# Altium schematic sheet Main Schematic.SchDoc
size A4
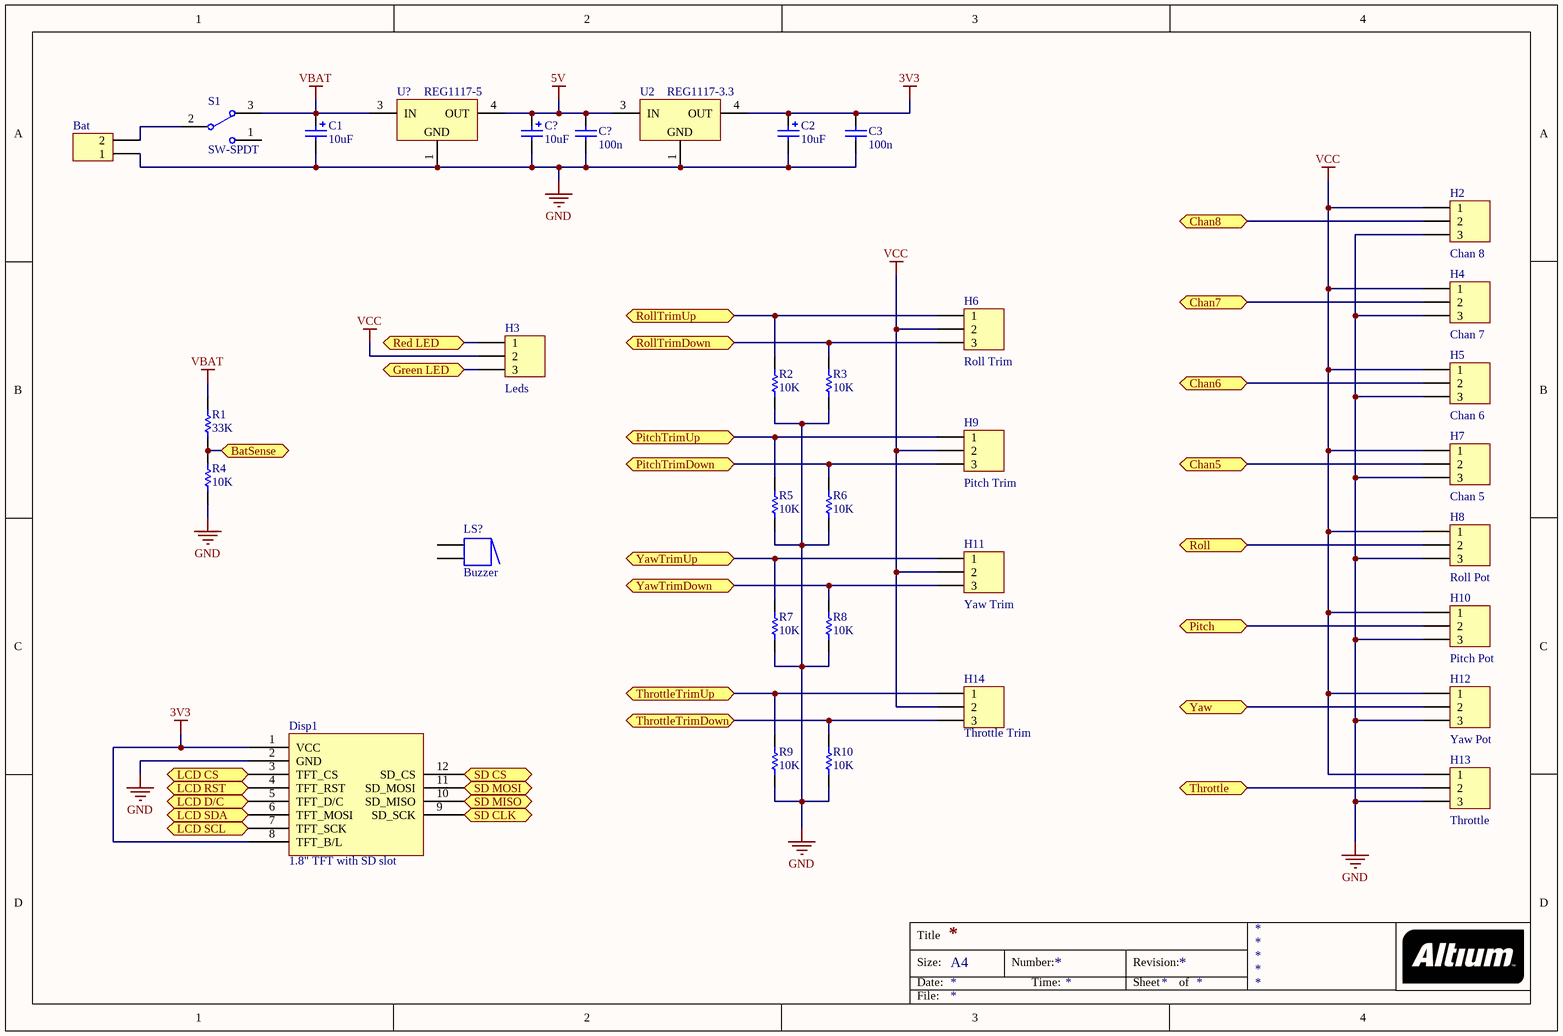
[diagram p0: Main Schematic.SchDoc]

## Parts
(Parts that share a designator on the sheet are numbered #1, #2 ... from top to bottom, then left to right.)
Bat  Header 2  [HDR1X2]  (value not drawn)
C1  value 10uF  [RB.1/.2]  (hidden comment: Cap Pol1)
C2  value 10uF  [RB.1/.2]  (hidden comment: Cap Pol1)
C3  value 100n  [RAD200_A]  (hidden comment: Cap)
C?#1  value 10uF  [RB.1/.2]  (hidden comment: Cap Pol1)
C?#2  value 100n  [RAD200_A]  (hidden comment: Cap)
Disp1  1.8" TFT with SD slot
H2  Chan 8  [HDR1X3]
H3  Leds  [HDR1X3]
H4  Chan 7  [HDR1X3]
H5  Chan 6  [HDR1X3]
H6  Roll Trim  [HDR1X3]
H7  Chan 5  [HDR1X3]
H8  Roll Pot  [HDR1X3]
H9  Pitch Trim  [HDR1X3]
H10  Pitch Pot  [HDR1X3]
H11  Yaw Trim  [HDR1X3]
H12  Yaw Pot  [HDR1X3]
H13  Throttle  [HDR1X3]
H14  Throttle Trim  [HDR1X3]
LS?  Buzzer  [ABSM-1574]
R1  value 33K  [AXIAL200]  (hidden comment: Res)
R2  value 10K  [0805]  (hidden comment: Res)
R3  value 10K  [0805]  (hidden comment: Res)
R4  value 10K  [AXIAL200]  (hidden comment: Res)
R5  value 10K  [0805]  (hidden comment: Res)
R6  value 10K  [0805]  (hidden comment: Res)
R7  value 10K  [0805]  (hidden comment: Res)
R8  value 10K  [0805]  (hidden comment: Res)
R9  value 10K  [0805]  (hidden comment: Res)
R10  value 10K  [0805]  (hidden comment: Res)
S1  SW-SPDT  [TL36WW15050]
U2  REG1117-3.3  [369A-13]
U?  REG1117-5  [369A-13]

## Ports
BatSense, Chan5, Chan6, Chan7, Chan8, Green LED, LCD CS, LCD D/C, LCD RST, LCD SCL, LCD SDA, Pitch, PitchTrimDown, PitchTrimUp, Red LED, Roll, RollTrimDown, RollTrimUp, SD CLK, SD CS, SD MISO, SD MOSI, Throttle, ThrottleTrimDown, ThrottleTrimUp, Yaw, YawTrimDown, YawTrimUp

## Nets
3V3: C2.1 C3.2 Disp1.1(VCC) Disp1.8(TFT_B/L) U2.4(OUT)
5V: C?#1.1 C?#2.2 U2.3(IN) U?.4(OUT)
GND: Bat.1 C1.2 C2.2 C3.1 C?#1.2 C?#2.1 Disp1.2(GND) H2.3 H4.3 H5.3 H7.3 H8.3 H10.3 H12.3 H13.3 R2.1 R3.1 R4.2 R5.1 R6.1 R7.1 R8.1 R9.2 R10.1 U2.1(GND) U?.1(GND)
VBAT: C1.1 R1.1 S1.3 U?.3(IN)
VCC: H2.1 H3.2 H4.1 H5.1 H6.2 H7.1 H8.1 H9.2 H10.1 H11.2 H12.1 H13.1 H14.2
BatSense: R1.2 R4.1 ; port BatSense
Chan5: H7.2 ; port Chan5
Chan6: H5.2 ; port Chan6
Chan7: H4.2 ; port Chan7
Chan8: H2.2 ; port Chan8
Green LED: H3.3 ; port Green LED
LCD CS: Disp1.3(TFT_CS) ; port LCD CS
LCD D/C: Disp1.5(TFT_D/C) ; port LCD D/C
LCD RST: Disp1.4(TFT_RST) ; port LCD RST
LCD SCL: Disp1.7(TFT_SCK) ; port LCD SCL
LCD SDA: Disp1.6(TFT_MOSI) ; port LCD SDA
Pitch: H10.2 ; port Pitch
PitchTrimDown: H9.3 R6.2 ; port PitchTrimDown
PitchTrimUp: H9.1 R5.2 ; port PitchTrimUp
Red LED: H3.1 ; port Red LED
Roll: H8.2 ; port Roll
RollTrimDown: H6.3 R3.2 ; port RollTrimDown
RollTrimUp: H6.1 R2.2 ; port RollTrimUp
SD CLK: Disp1.9(SD_SCK) ; port SD CLK
SD CS: Disp1.12(SD_CS) ; port SD CS
SD MISO: Disp1.10(SD_MISO) ; port SD MISO
SD MOSI: Disp1.11(SD_MOSI) ; port SD MOSI
Throttle: H13.2 ; port Throttle
ThrottleTrimDown: H14.3 R10.2 ; port ThrottleTrimDown
ThrottleTrimUp: H14.1 R9.1 ; port ThrottleTrimUp
Yaw: H12.2 ; port Yaw
YawTrimDown: H11.3 R8.2 ; port YawTrimDown
YawTrimUp: H11.1 R7.2 ; port YawTrimUp
NetBat_2: Bat.2 S1.2
NetLS?_1: LS?.1 LS?.1A
NetLS?_2: LS?.2 LS?.2A

Not connected (* = marked no-connect by the designer): S1 1

## Notes on the sheet
- Title
- Size:
- Date:
- A4
- Number:
- Time:
- Revision:
- Sheet
- of
- File:

## Library data of the parts
Bat = Header 2: Header, 2-Pin; Manufacturer: Generic Components; Class: Connector
C1 C2 C?#1 = Cap Pol1: Polarized Capacitor (Radial); Manufacturer: Generic Components; Class: Passive; Published: 08/06/2000; Publisher: Altium Hobart Technology Centre; SubClass: Capacitor
C3 C?#2 = Cap: Capacitor; Manufacturer: Generic Components; Class: Passive; Published: 08/06/2000; Publisher: Altium Hobart Technology Centre; SubClass: Capacitor
H2-H14 = Header 3: Header, 3-Pin; Manufacturer: Generic Components; Class: Connector
LS? = Buzzer: Magnetic Transducer Buzzer; Published: 24-Mar-1999; LatestRevisionDate: 17-Dec-2003; LatestRevisionNote: Schematic revised, PCB Footprint replaced.; DatasheetVersion: 17-Dec-2003; PackageReference: ABSM-1574; Publisher: Altium Limited; PackageDescription: Magnetic Transducer Buzzer; ComponentLink1Description: Manufacturer Link; ComponentLink1URL: http://www.megastar.com/linecard/buzzmode/index.php
R1-R10 = Res: Resistor; Manufacturer: Generic Components; Class: Passive; Published: 08/06/2000; Publisher: Altium Hobart Technology Centre; SubClass: Resistor
S1 = SW-SPDT: SPDT Subminiature Toggle Switch, Right Angle Mounting, Vertical Actuation; Published: 24-Mar-1999; LatestRevisionDate: 17-Dec-2003; LatestRevisionNote: Schematic revised, PCB Footprint replaced.; DatasheetVersion: 05-Dec-2000; PackageReference: TL36WW15050; Publisher: Altium Limited; PackageDescription: Switch; 4 Leads; ComponentLink1Description: Manufacturer Link; ComponentLink1URL: http://www.apem.com
U2 U? = REG1117-3.3: 800mA and 1A Low Dropout Positive Regulator 2.85V, 3.3V, 5V, and Adjustable; PackageDocument: revC; Published: 8-Jun-2000; LatestRevisionDate: 17-Jul-2002; LatestRevisionNote: Re-released for DXP Platform.; DatasheetDocument: Sep-1997; PackageReference: ZZ311; Publisher: Altium Limited; ComponentLink1Description: Manufacturer Link; ComponentLink1URL: http://www.ti.com/